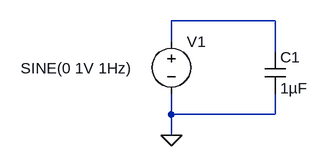
[diagram p0: schematic Draft2.asc]
Draft2.asc, the LTspice schematic file:
Version 4
SHEET 1 880 680
WIRE 208 144 48 144
WIRE 48 176 48 144
WIRE 208 192 208 144
WIRE 48 288 48 256
WIRE 208 288 208 256
WIRE 208 288 48 288
WIRE 48 320 48 288
FLAG 48 320 0
SYMBOL cap 192 192 R0
SYMATTR InstName C1
SYMATTR Value 1µF
SYMBOL voltage 48 160 R0
WINDOW 3 -232 57 Left 2
WINDOW 123 0 0 Left 0
WINDOW 39 0 0 Left 0
SYMATTR InstName V1
SYMATTR Value SINE(0 1V 1Hz)

The netlist it stands for:
* Draft2.asc
C1 N001 0 1µF
V1 N001 0 SINE(0 1V 1Hz)
.backanno
.end